# Altium project practice.PrjPcb
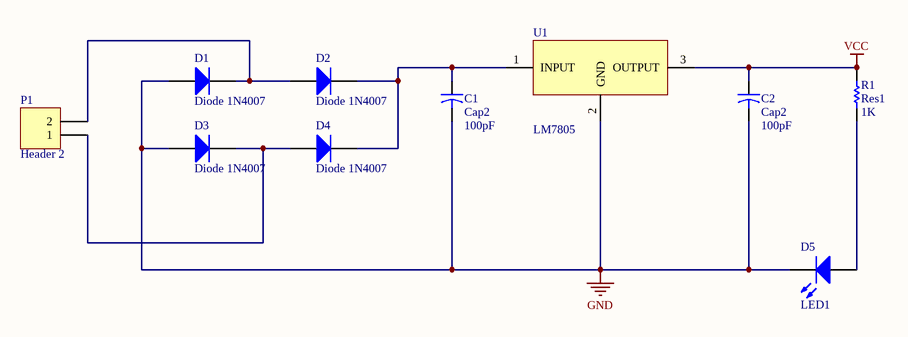
[diagram p0: schematic.SchDoc]
1 sheet, 10 parts. Net scope: global (net labels, ports and power ports of the same name join across sheets).
Board file: pcb.PcbDoc

## Sheet schematic.SchDoc
size A

### Parts
C1  Cap2  value 100pF  [CAPR5-4X5]
C2  Cap2  value 100pF  [CAPR5-4X5]
D1  Diode 1N4007  [DO-41]
D2  Diode 1N4007  [DO-41]
D3  Diode 1N4007  [DO-41]
D4  Diode 1N4007  [DO-41]
D5  LED1  [LED-1]
P1  Header 2  [HDR1X2]
R1  Res1  value 1K  [AXIAL-0.3]
U1  LM7805  [LM7805]

### Nets
GND: C1.2 C2.2 D1.1(A) D3.1(A) D5.2(K) U1.2(GND)
VCC: C2.1 R1.2 U1.3(OUTPUT)
NetC1_1: C1.1 D2.2(K) D4.2(K) U1.1(INPUT)
NetD1_2: D1.2(K) D2.1(A) P1.2
NetD3_2: D3.2(K) D4.1(A) P1.1
NetD5_1: D5.1(A) R1.1

### Library data of the parts
C1 C2 = Cap2: Capacitor; Published: 23-Sep-2002; PackageReference: CAPR5-4X5; Publisher: Altium Limited; PackageDescription: Capacitor; 2 Leads
D1-D4 = Diode 1N4007: 1 Amp General Purpose Rectifier; Published: 8-Jun-2000; LatestRevisionDate: 17-Jul-2002; LatestRevisionNote: Re-released for DXP Platform.; DatasheetVersion: 1998; PackageVersion: Aug-1999; PackageReference: DO-41; Publisher: Altium Limited; PackageDescription: Diode, Axial; Body 5.2 x 2.7 mm (LxDia. max), Lead Dia. 0.86 mm (max); Code_JEDEC: DO-204-AL; ComponentLink1Description: Manufacturer Link; ComponentLink1URL: http://www.fairchildsemi.com/; ComponentLink2Description: Datasheet; ComponentLink2URL: http://www.fairchildsemi.com/ds/1N%2F1N4001.pdf
D5 = LED1: Typical RED GaAs LED; Published: 8-Jun-2000; LatestRevisionDate: 08-Jul-2005; LatestRevisionNote: Mech Layer 1 removed.; PackageReference: LED-1; Publisher: Altium Limited; PackageDescription: LED; 2 Leads
P1 = Header 2: Header, 2-Pin; LatestRevisionDate: 17-Jul-2002; LatestRevisionNote: Re-released for DXP Platform.; Publisher: Altium Limited
R1 = Res1: Resistor; Published: 8-Jun-2000; LatestRevisionDate: 17-Jul-2002; LatestRevisionNote: Re-released for DXP Platform.; PackageReference: AXIAL-0.3; Publisher: Altium Limited; PackageDescription: Axial Device, Thru-Hole; 2 Leads; 0.3 in Pin Spacing
U1 = Component_1